# EasyEDA schematic SCH_cligno-ESP32-C3_2025-02-09.json
TITLE: Eclairage Trottinette; REV: 1.0; Date: 2023-12-29; Sheet: 1/1; Drawn By: minusmaster; Company: Your Company
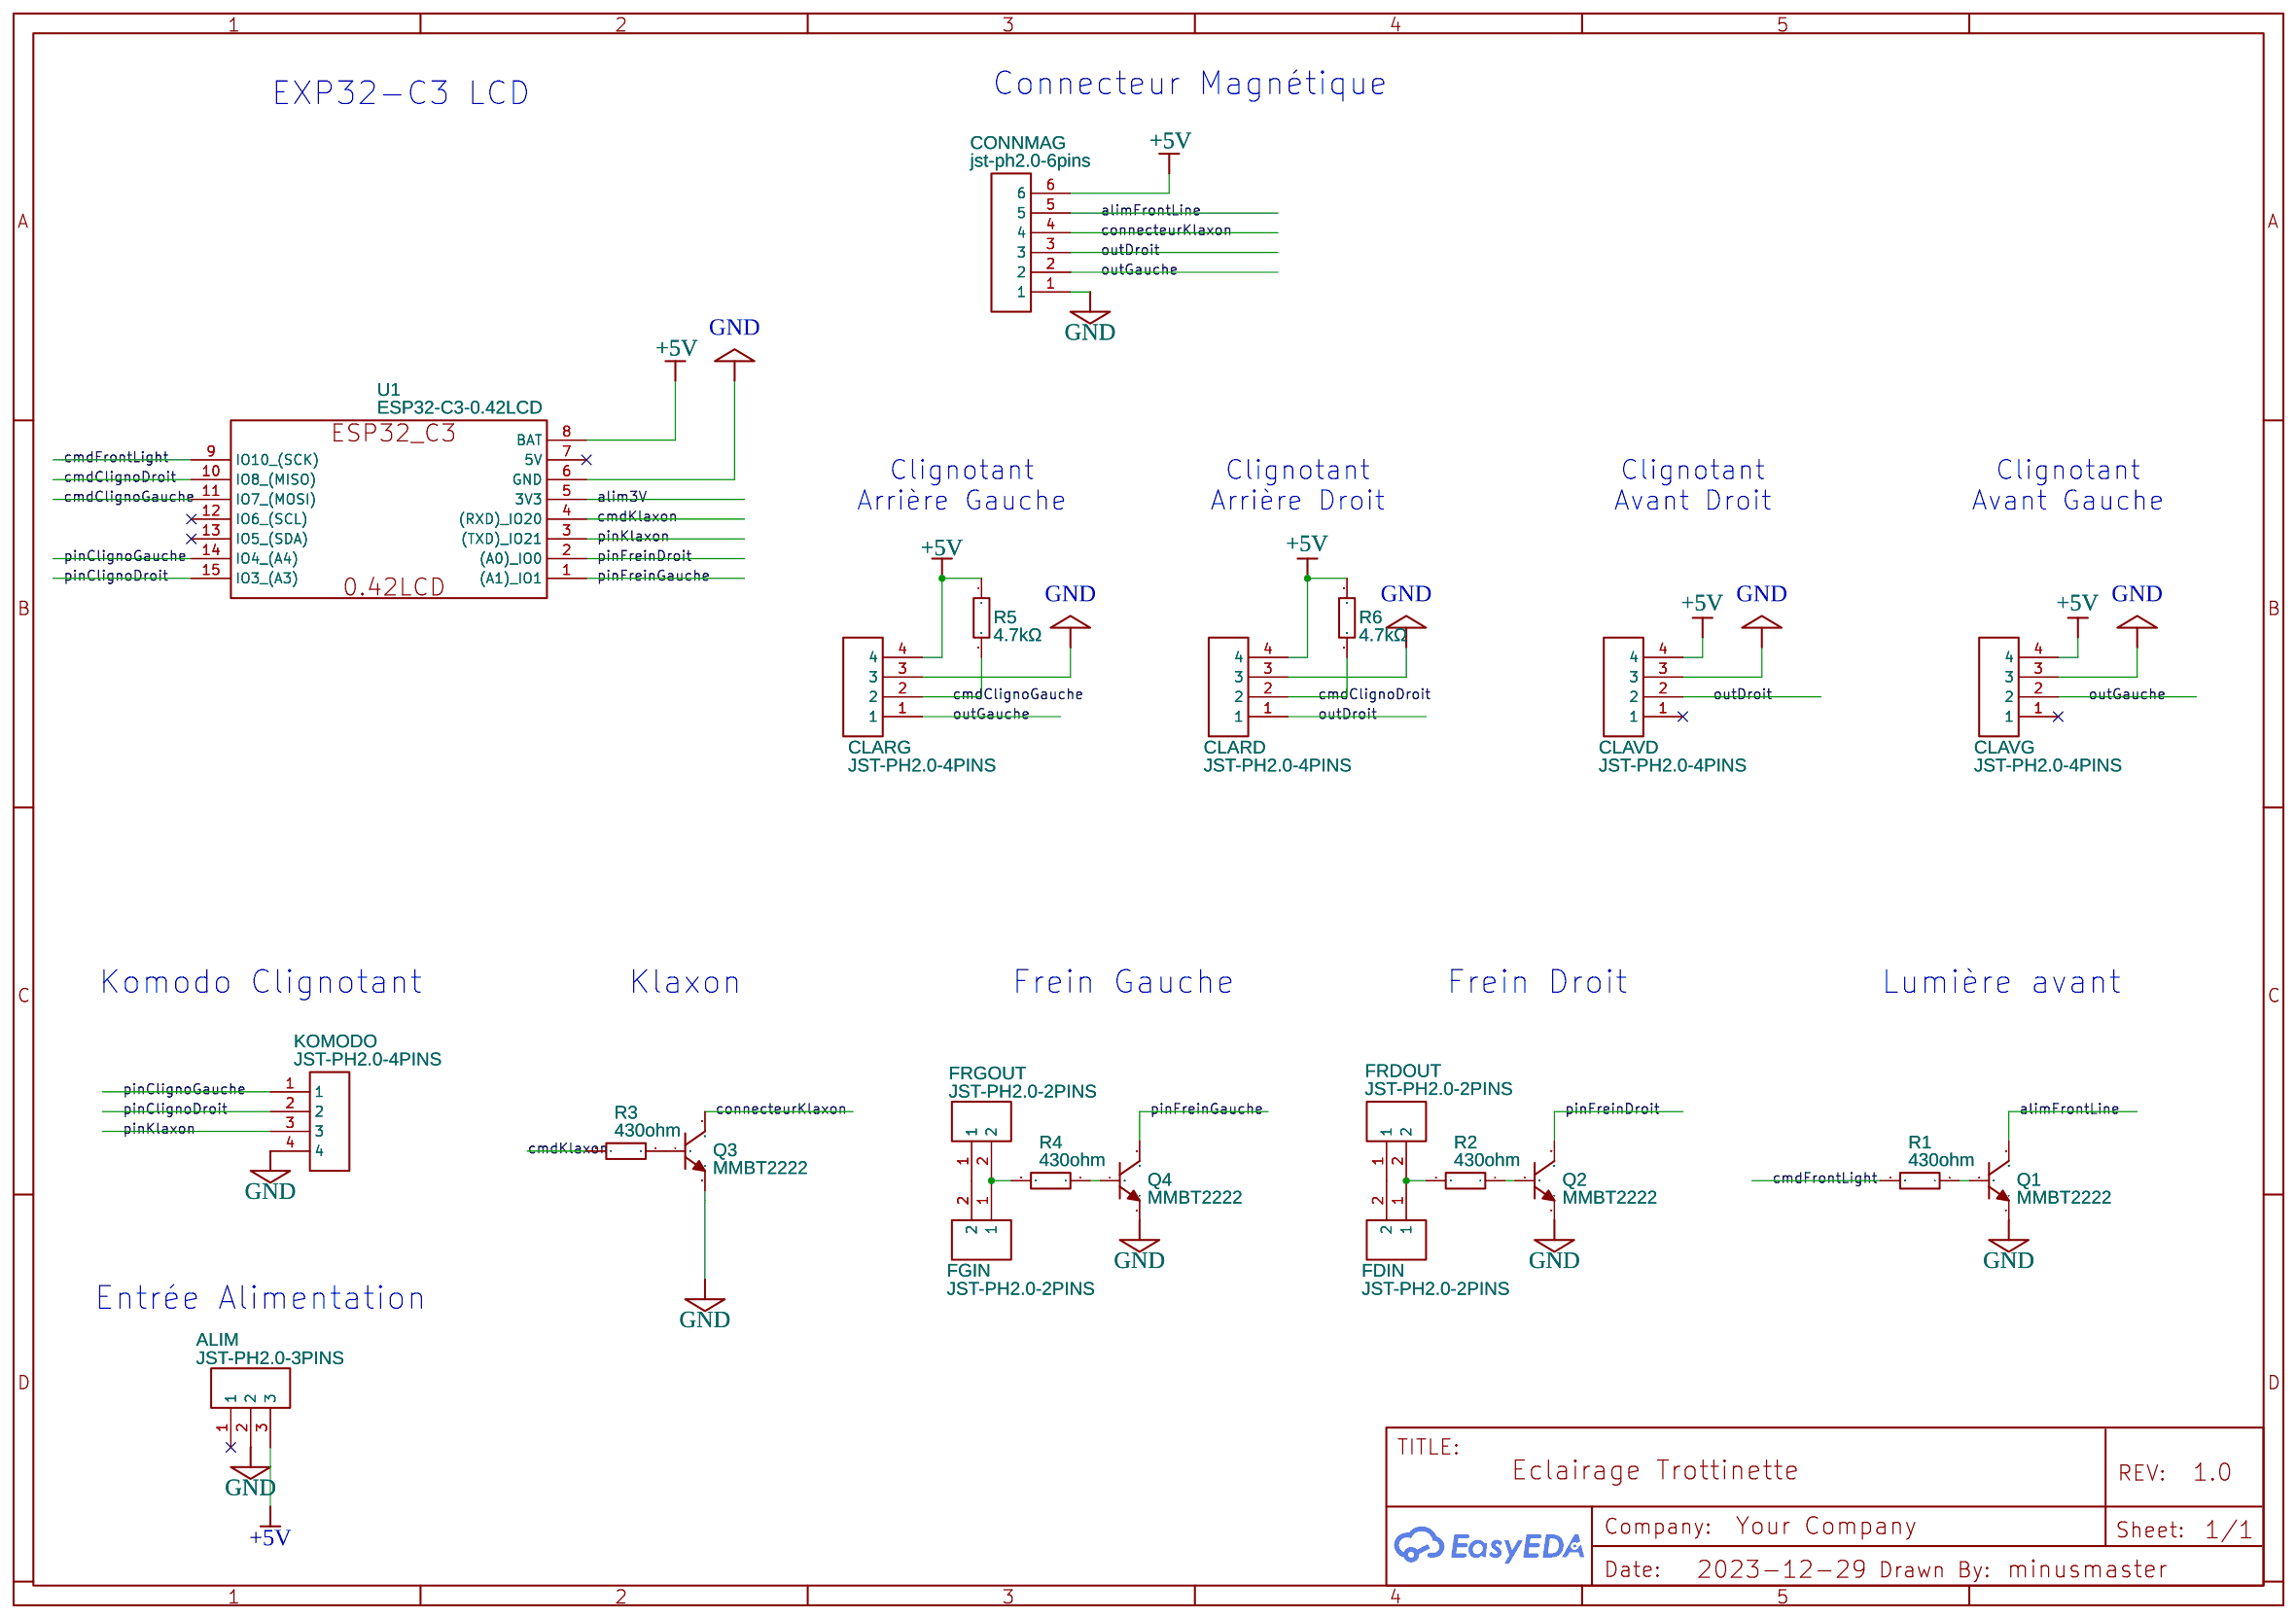
[diagram p0: schematic sheet]

## Parts
ALIM  JST-PH2.0-3PINS  [JST-PH2.0-3PINS]
CLARD  JST-PH2.0-4PINS  [JST-PH2.0-4PINS]
CLARG  JST-PH2.0-4PINS  [JST-PH2.0-4PINS]
CLAVD  JST-PH2.0-4PINS  [JST-PH2.0-4PINS]
CLAVG  JST-PH2.0-4PINS  [JST-PH2.0-4PINS]
CONNMAG  jst-ph2.0-6pins  [JST-PH2.0-6PINS]
FDIN  JST-PH2.0-2PINS  [JST-PH2.0-2PINS]
FGIN  JST-PH2.0-2PINS  [JST-PH2.0-2PINS]
FRDOUT  JST-PH2.0-2PINS  [JST-PH2.0-2PINS]
FRGOUT  JST-PH2.0-2PINS  [JST-PH2.0-2PINS]
KOMODO  JST-PH2.0-4PINS  [JST-PH2.0-4PINS]
Q1  MMBT2222  [SOT-23-3_L2.9-W1.4-P1.91-LS2.6-BR]
Q2  MMBT2222  [SOT-23-3_L2.9-W1.4-P1.91-LS2.6-BR]
Q3  MMBT2222  [SOT-23-3_L2.9-W1.4-P1.91-LS2.6-BR]
Q4  MMBT2222  [SOT-23-3_L2.9-W1.4-P1.91-LS2.6-BR]
R1  430ohm  [R1206]
R2  430ohm  [R1206]
R3  430ohm  [R1206]
R4  430ohm  [R1206]
R5  4.7kΩ  [R1206]
R6  4.7kΩ  [R1206]
U1  ESP32-C3-0.42LCD  [ESP32-C3-0.42LCD]

## Library data of the parts
ALIM = JST-PH2.0-3PINS: Contributor: alieksieiev.yurii
CLARD CLARG CLAVD CLAVG KOMODO = JST-PH2.0-4PINS: Contributor: jfdore32
CONNMAG = jst-ph2.0-6pins: Contributor: aesindustries.drive
FDIN FGIN FRDOUT FRGOUT = JST-PH2.0-2PINS: Contributor: alieksieiev.yurii
Q1-Q4 = MMBT2222: Contributor: LCSC; Supplier: LCSC; Supplier Part: C2891810; Manufacturer: YONGYUTAI(永裕泰); JLCPCB Part Class: Extended Part; link: https://lcsc.com/eda_search?q=C2891810&%26type=1&ref=editor
R1-R6 = RMC12061205%N: Contributor: LCSC; Supplier: LCSC; Supplier Part: C269754; Manufacturer: Tyohm(幸亚电阻); JLCPCB Part Class: Extended Part; link: https://lcsc.com/eda_search?q=C269754&%26type=1&ref=editor
U1 = ESP32-C3-0.42LCD: Contributor: oskarnoriyuki

## Nets
+5V: ALIM.3 CLARD.4 CLARG.4 CLAVD.4 CLAVG.4 CONNMAG.6 R5.1 R6.1 U1.8(BAT)
GND: ALIM.2 CLARD.3 CLARG.3 CLAVD.3 CLAVG.3 CONNMAG.1 KOMODO.4 Q1.2(E) Q2.2(E) Q3.2(E) Q4.2(E) U1.6(GND)
alim3V: U1.5(3V3)
alimFrontLine: CONNMAG.5 Q1.3(C)
cmdClignoDroit: CLARD.2 R6.2 U1.10(IO8 (MISO))
cmdClignoGauche: CLARG.2 R5.2 U1.11(IO7 (MOSI))
cmdFrontLight: R1.2 U1.9(IO10 (SCK))
cmdKlaxon: R3.2 U1.4((RXD) IO20)
connecteurKlaxon: CONNMAG.4 Q3.3(C)
outDroit: CLARD.1 CLAVD.2 CONNMAG.3
outGauche: CLARG.1 CLAVG.2 CONNMAG.2
pinClignoDroit: KOMODO.2 U1.15(IO3 (A3))
pinClignoGauche: KOMODO.1 U1.14(IO4 (A4))
pinFreinDroit: Q2.3(C) U1.2((A0) IO0)
pinFreinGauche: Q4.3(C) U1.1((A1) IO1)
pinKlaxon: KOMODO.3 U1.3((TXD) IO21)
Net-(FDIN-1): FDIN.1 FRDOUT.2 R2.2
Net-(FDIN-2): FDIN.2 FRDOUT.1
Net-(FGIN-1): FGIN.1 FRGOUT.2 R4.2
Net-(FGIN-2): FGIN.2 FRGOUT.1
Net-(Q1-1): Q1.1(B) R1.1
Net-(Q2-1): Q2.1(B) R2.1
Net-(Q3-1): Q3.1(B) R3.1
Net-(Q4-1): Q4.1(B) R4.1

Not connected (* = marked no-connect by the designer): ALIM 1*; CLAVD 1*; CLAVG 1*; U1 7(5V)* 12(IO6 (SCL))* 13(IO5 (SDA))*

## Notes on the sheet
- Connecteur Magnétique
- EXP32-C3 LCD
- Clignotant
  Arrière Gauche
- Clignotant
  Arrière Droit
- Clignotant
  Avant Droit
- Clignotant
  Avant Gauche
- Komodo Clignotant
- Klaxon
- Frein Gauche
- Frein Droit
- Lumière avant
- Entrée Alimentation
